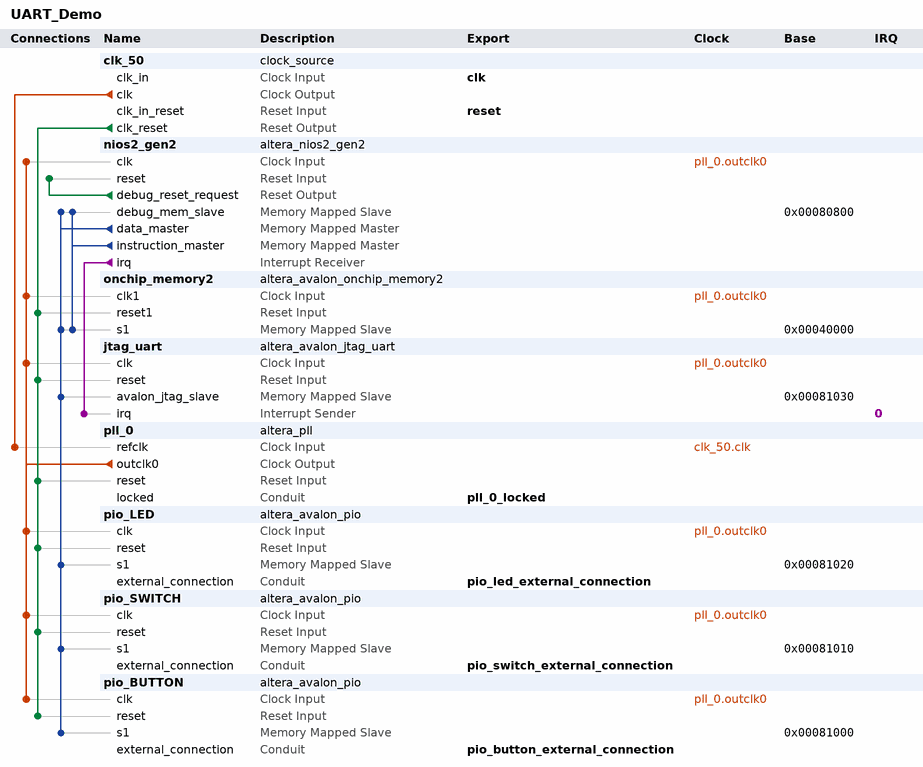
[diagram p0: system contents]
# Platform Designer (Qsys) system UART_Demo, Cyclone V 5CEBA4F23C7
# Parameters at their usual value, and those the tool derives, are not listed.
package require -exact qsys 22.1
create_system UART_Demo
set_project_property DEVICE_FAMILY {Cyclone V}
set_project_property DEVICE 5CEBA4F23C7

add_instance clk_50 clock_source 22.1
set_instance_parameter_value clk_50 clockFrequency 50000000

add_instance nios2_gen2 altera_nios2_gen2 22.1
set_instance_parameter_value nios2_gen2 dcache_size 2048
set_instance_parameter_value nios2_gen2 exceptionSlave onchip_memory2.s1
set_instance_parameter_value nios2_gen2 icache_size 4096
set_instance_parameter_value nios2_gen2 impl Fast
set_instance_parameter_value nios2_gen2 resetSlave onchip_memory2.s1

add_instance onchip_memory2 altera_avalon_onchip_memory2 22.1
set_instance_parameter_value onchip_memory2 dataWidth 32
set_instance_parameter_value onchip_memory2 dualPort false
set_instance_parameter_value onchip_memory2 initMemContent true
set_instance_parameter_value onchip_memory2 initializationFileName onchip_mem.hex
set_instance_parameter_value onchip_memory2 memorySize 160000

add_instance jtag_uart altera_avalon_jtag_uart 22.1
set_instance_parameter_value jtag_uart simInteractiveOptions NO_INTERACTIVE_WINDOWS

add_instance pll_0 altera_pll 22.1
set_instance_parameter_value pll_0 gui_device_speed_grade 1
set_instance_parameter_value pll_0 gui_number_of_clocks 1
set_instance_parameter_value pll_0 gui_operation_mode direct
set_instance_parameter_value pll_0 gui_output_clock_frequency0 100.0
set_instance_parameter_value pll_0 gui_pll_mode {Integer-N PLL}
set_instance_parameter_value pll_0 gui_reference_clock_frequency 50.0
set_instance_parameter_value pll_0 gui_use_locked true

add_instance pio_LED altera_avalon_pio 22.1
set_instance_parameter_value pio_LED direction Output
set_instance_parameter_value pio_LED width 8

add_instance pio_SWITCH altera_avalon_pio 22.1
set_instance_parameter_value pio_SWITCH direction Input
set_instance_parameter_value pio_SWITCH width 3

add_instance pio_BUTTON altera_avalon_pio 22.1
set_instance_parameter_value pio_BUTTON direction Input
set_instance_parameter_value pio_BUTTON width 2

# connections
add_connection clk_50.clk pll_0.refclk clock
add_connection pll_0.outclk0 jtag_uart.clk clock
add_connection pll_0.outclk0 nios2_gen2.clk clock
add_connection pll_0.outclk0 onchip_memory2.clk1 clock
add_connection pll_0.outclk0 pio_BUTTON.clk clock
add_connection pll_0.outclk0 pio_LED.clk clock
add_connection pll_0.outclk0 pio_SWITCH.clk clock
add_connection clk_50.clk_reset jtag_uart.reset reset
add_connection clk_50.clk_reset onchip_memory2.reset1 reset
add_connection clk_50.clk_reset pio_BUTTON.reset reset
add_connection clk_50.clk_reset pio_LED.reset reset
add_connection clk_50.clk_reset pio_SWITCH.reset reset
add_connection clk_50.clk_reset pll_0.reset reset
add_connection nios2_gen2.debug_reset_request nios2_gen2.reset reset
add_connection nios2_gen2.data_master jtag_uart.avalon_jtag_slave avalon
set_connection_parameter_value nios2_gen2.data_master/jtag_uart.avalon_jtag_slave baseAddress 0x00081030
add_connection nios2_gen2.data_master nios2_gen2.debug_mem_slave avalon
set_connection_parameter_value nios2_gen2.data_master/nios2_gen2.debug_mem_slave baseAddress 0x00080800
add_connection nios2_gen2.data_master onchip_memory2.s1 avalon
set_connection_parameter_value nios2_gen2.data_master/onchip_memory2.s1 baseAddress 0x00040000
add_connection nios2_gen2.data_master pio_BUTTON.s1 avalon
set_connection_parameter_value nios2_gen2.data_master/pio_BUTTON.s1 baseAddress 0x00081000
add_connection nios2_gen2.data_master pio_LED.s1 avalon
set_connection_parameter_value nios2_gen2.data_master/pio_LED.s1 baseAddress 0x00081020
add_connection nios2_gen2.data_master pio_SWITCH.s1 avalon
set_connection_parameter_value nios2_gen2.data_master/pio_SWITCH.s1 baseAddress 0x00081010
add_connection nios2_gen2.instruction_master nios2_gen2.debug_mem_slave avalon
set_connection_parameter_value nios2_gen2.instruction_master/nios2_gen2.debug_mem_slave baseAddress 0x00080800
add_connection nios2_gen2.instruction_master onchip_memory2.s1 avalon
set_connection_parameter_value nios2_gen2.instruction_master/onchip_memory2.s1 baseAddress 0x00040000
add_connection nios2_gen2.irq jtag_uart.irq interrupt
set_connection_parameter_value nios2_gen2.irq/jtag_uart.irq irqNumber 0

# exported interfaces
add_interface clk clock sink
set_interface_property clk EXPORT_OF clk_50.clk_in
add_interface pio_button_external_connection conduit end
set_interface_property pio_button_external_connection EXPORT_OF pio_BUTTON.external_connection
add_interface pio_led_external_connection conduit end
set_interface_property pio_led_external_connection EXPORT_OF pio_LED.external_connection
add_interface pio_switch_external_connection conduit end
set_interface_property pio_switch_external_connection EXPORT_OF pio_SWITCH.external_connection
add_interface pll_0_locked conduit end
set_interface_property pll_0_locked EXPORT_OF pll_0.locked
add_interface reset reset sink
set_interface_property reset EXPORT_OF clk_50.clk_in_reset

set_interconnect_requirement {$system} qsys_mm.clockCrossingAdapter HANDSHAKE
set_interconnect_requirement {$system} qsys_mm.enableEccProtection FALSE
set_interconnect_requirement {$system} qsys_mm.insertDefaultSlave FALSE
set_interconnect_requirement {$system} qsys_mm.maxAdditionalLatency 1

save_system UART_Demo.qsys
